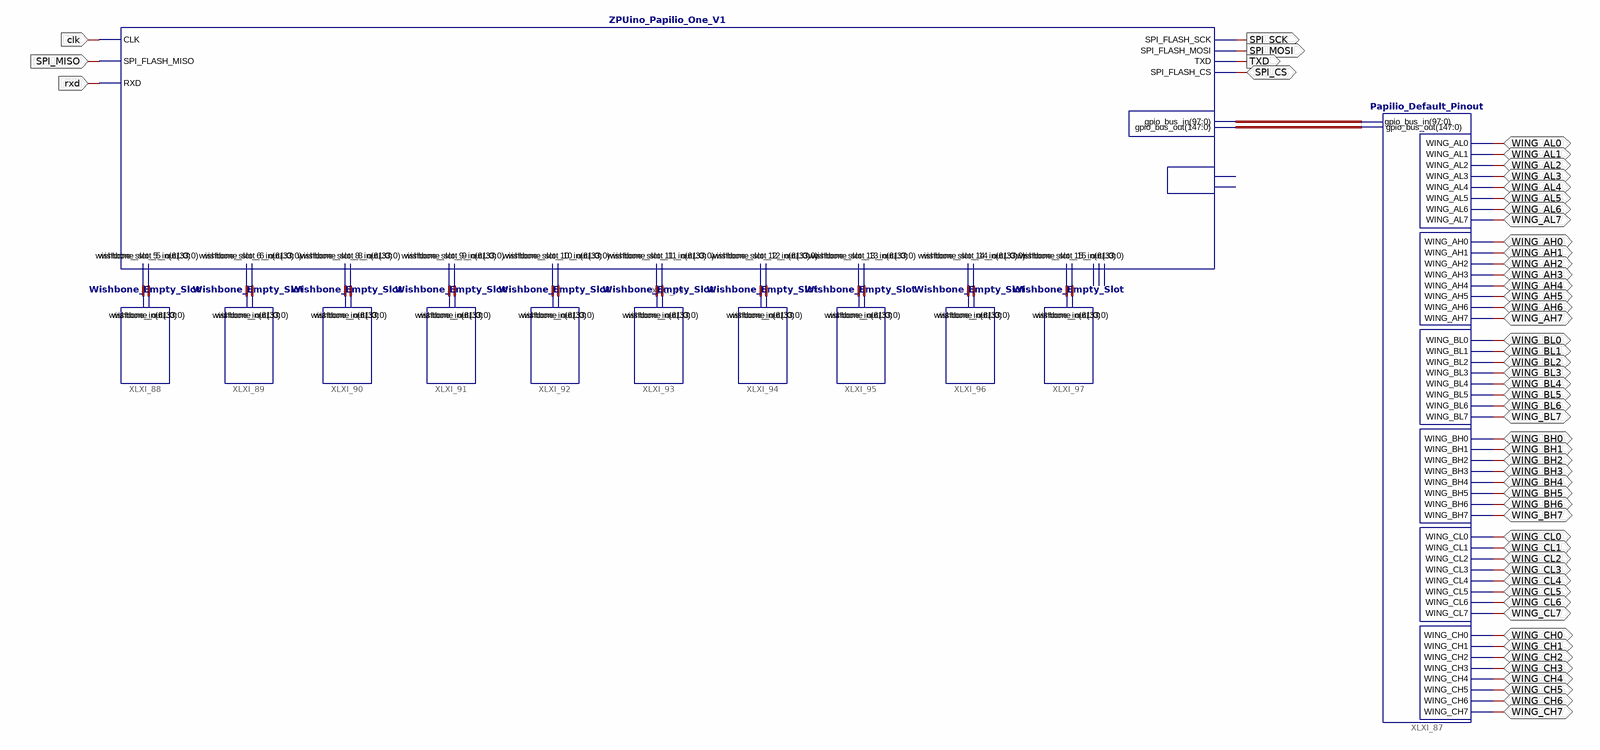
[diagram p0: schematic sheet 1]
// Xilinx ISE schematic Papilio_SOC_Base_Papilio_One.sch (spartan3e) as structural Verilog: 12 symbols, 55 ports
module Papilio_SOC_Base_Papilio_One (
  input  clk,
  input  SPI_MISO,
  input  rxd,
  inout  SPI_CS,
  inout  WING_AH0,
  inout  WING_AH1,
  inout  WING_AH2,
  inout  WING_AH3,
  inout  WING_AH4,
  inout  WING_AH5,
  inout  WING_AH6,
  inout  WING_AH7,
  inout  WING_AL0,
  inout  WING_AL1,
  inout  WING_AL2,
  inout  WING_AL3,
  inout  WING_AL4,
  inout  WING_AL5,
  inout  WING_AL6,
  inout  WING_AL7,
  inout  WING_BH0,
  inout  WING_BH1,
  inout  WING_BH2,
  inout  WING_BH3,
  inout  WING_BH4,
  inout  WING_BH5,
  inout  WING_BH6,
  inout  WING_BH7,
  inout  WING_BL0,
  inout  WING_BL1,
  inout  WING_BL2,
  inout  WING_BL3,
  inout  WING_BL4,
  inout  WING_BL5,
  inout  WING_BL6,
  inout  WING_BL7,
  inout  WING_CL0,
  inout  WING_CL1,
  inout  WING_CL2,
  inout  WING_CL3,
  inout  WING_CL4,
  inout  WING_CL5,
  inout  WING_CL6,
  inout  WING_CL7,
  inout  WING_CH0,
  inout  WING_CH1,
  inout  WING_CH2,
  inout  WING_CH3,
  inout  WING_CH4,
  inout  WING_CH5,
  inout  WING_CH6,
  inout  WING_CH7,
  output SPI_MOSI,
  output TXD,
  output SPI_SCK
);

  wire [33:0] XLXN_586, XLXN_588, XLXN_590, XLXN_592, XLXN_594, XLXN_596, XLXN_598, XLXN_600, XLXN_602,
       XLXN_604;
  wire [61:0] XLXN_585, XLXN_587, XLXN_589, XLXN_591, XLXN_593, XLXN_595, XLXN_597, XLXN_599, XLXN_601,
       XLXN_603;
  wire [97:0] XLXN_583;
  wire [147:0] XLXN_584;

  ZPUino_Papilio_One_V1 XLXI_59 (
    .SPI_FLASH_SCK(SPI_SCK), .SPI_FLASH_MOSI(SPI_MOSI), .TXD(TXD), .SPI_FLASH_CS(SPI_CS),
    .gpio_bus_out(XLXN_584), .gpio_bus_in(XLXN_583), .CLK(clk), .SPI_FLASH_MISO(SPI_MISO), .RXD(rxd),
    .wishbone_slot_8_in(XLXN_589), .wishbone_slot_8_out(XLXN_590), .wishbone_slot_9_in(XLXN_591),
    .wishbone_slot_9_out(XLXN_592), .wishbone_slot_10_in(XLXN_593), .wishbone_slot_10_out(XLXN_594),
    .wishbone_slot_11_in(XLXN_595), .wishbone_slot_11_out(XLXN_596), .wishbone_slot_12_in(XLXN_597),
    .wishbone_slot_12_out(XLXN_598), .wishbone_slot_13_in(XLXN_599), .wishbone_slot_13_out(XLXN_600),
    .wishbone_slot_14_in(XLXN_601), .wishbone_slot_14_out(XLXN_602), .wishbone_slot_15_in(XLXN_603),
    .wishbone_slot_15_out(XLXN_604), .wishbone_slot_5_out(XLXN_586), .wishbone_slot_5_in(XLXN_585),
    .wishbone_slot_6_in(XLXN_587), .wishbone_slot_6_out(XLXN_588));  // open: clk_96Mhz, clk_1Mhz, wishbone_slot_video_in, wishbone_slot_video_out, vgaclkout
  Papilio_Default_Pinout XLXI_87 (
    .gpio_bus_out(XLXN_584), .gpio_bus_in(XLXN_583), .WING_AH0(WING_AH0), .WING_AH1(WING_AH1),
    .WING_AH2(WING_AH2), .WING_AH3(WING_AH3), .WING_AH4(WING_AH4), .WING_AH5(WING_AH5), .WING_AH6(WING_AH6),
    .WING_AH7(WING_AH7), .WING_AL0(WING_AL0), .WING_AL1(WING_AL1), .WING_AL2(WING_AL2), .WING_AL3(WING_AL3),
    .WING_AL4(WING_AL4), .WING_AL5(WING_AL5), .WING_AL6(WING_AL6), .WING_AL7(WING_AL7), .WING_BH0(WING_BH0),
    .WING_BH1(WING_BH1), .WING_BH2(WING_BH2), .WING_BH3(WING_BH3), .WING_BH4(WING_BH4), .WING_BH5(WING_BH5),
    .WING_BH6(WING_BH6), .WING_BH7(WING_BH7), .WING_BL0(WING_BL0), .WING_BL1(WING_BL1), .WING_BL2(WING_BL2),
    .WING_BL3(WING_BL3), .WING_BL4(WING_BL4), .WING_BL5(WING_BL5), .WING_BL6(WING_BL6), .WING_BL7(WING_BL7),
    .WING_CL0(WING_CL0), .WING_CL1(WING_CL1), .WING_CL2(WING_CL2), .WING_CL3(WING_CL3), .WING_CL4(WING_CL4),
    .WING_CL5(WING_CL5), .WING_CL6(WING_CL6), .WING_CL7(WING_CL7), .WING_CH0(WING_CH0), .WING_CH1(WING_CH1),
    .WING_CH2(WING_CH2), .WING_CH3(WING_CH3), .WING_CH4(WING_CH4), .WING_CH5(WING_CH5), .WING_CH6(WING_CH6),
    .WING_CH7(WING_CH7));
  Wishbone_Empty_Slot XLXI_88 (.wishbone_in(XLXN_585), .wishbone_out(XLXN_586));
  Wishbone_Empty_Slot XLXI_89 (.wishbone_in(XLXN_587), .wishbone_out(XLXN_588));
  Wishbone_Empty_Slot XLXI_90 (.wishbone_in(XLXN_589), .wishbone_out(XLXN_590));
  Wishbone_Empty_Slot XLXI_91 (.wishbone_in(XLXN_591), .wishbone_out(XLXN_592));
  Wishbone_Empty_Slot XLXI_92 (.wishbone_in(XLXN_593), .wishbone_out(XLXN_594));
  Wishbone_Empty_Slot XLXI_93 (.wishbone_in(XLXN_595), .wishbone_out(XLXN_596));
  Wishbone_Empty_Slot XLXI_94 (.wishbone_in(XLXN_597), .wishbone_out(XLXN_598));
  Wishbone_Empty_Slot XLXI_95 (.wishbone_in(XLXN_599), .wishbone_out(XLXN_600));
  Wishbone_Empty_Slot XLXI_96 (.wishbone_in(XLXN_601), .wishbone_out(XLXN_602));
  Wishbone_Empty_Slot XLXI_97 (.wishbone_in(XLXN_603), .wishbone_out(XLXN_604));
endmodule
